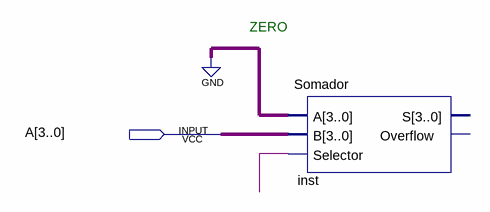
[diagram p0: schematic sheet]
// Quartus schematic Complemento2.bdf as structural Verilog: 1 symbols, 1 pins
module Complemento2 (
  input  [3:0] A
);

  wire undriven;

  Somador inst (.A(4'b0000), .B(A), .Selector(undriven));  // open: S, Overflow

  // Notes on the sheet:
  //   ZERO
endmodule
